# Altium schematic sheet Pi_HDMI.SchDoc: =DocumentName
size B; DrawnBy: Cary Smith; Organization: Las Cumbres Observatoy; Address1: 6740 Cortona Dr.; Address2: Suite 102; Address3: Goleta, CA 93117; DocumentNumber: 1; Revision: 1; SheetNumber: 1; SheetTotal: 1000's
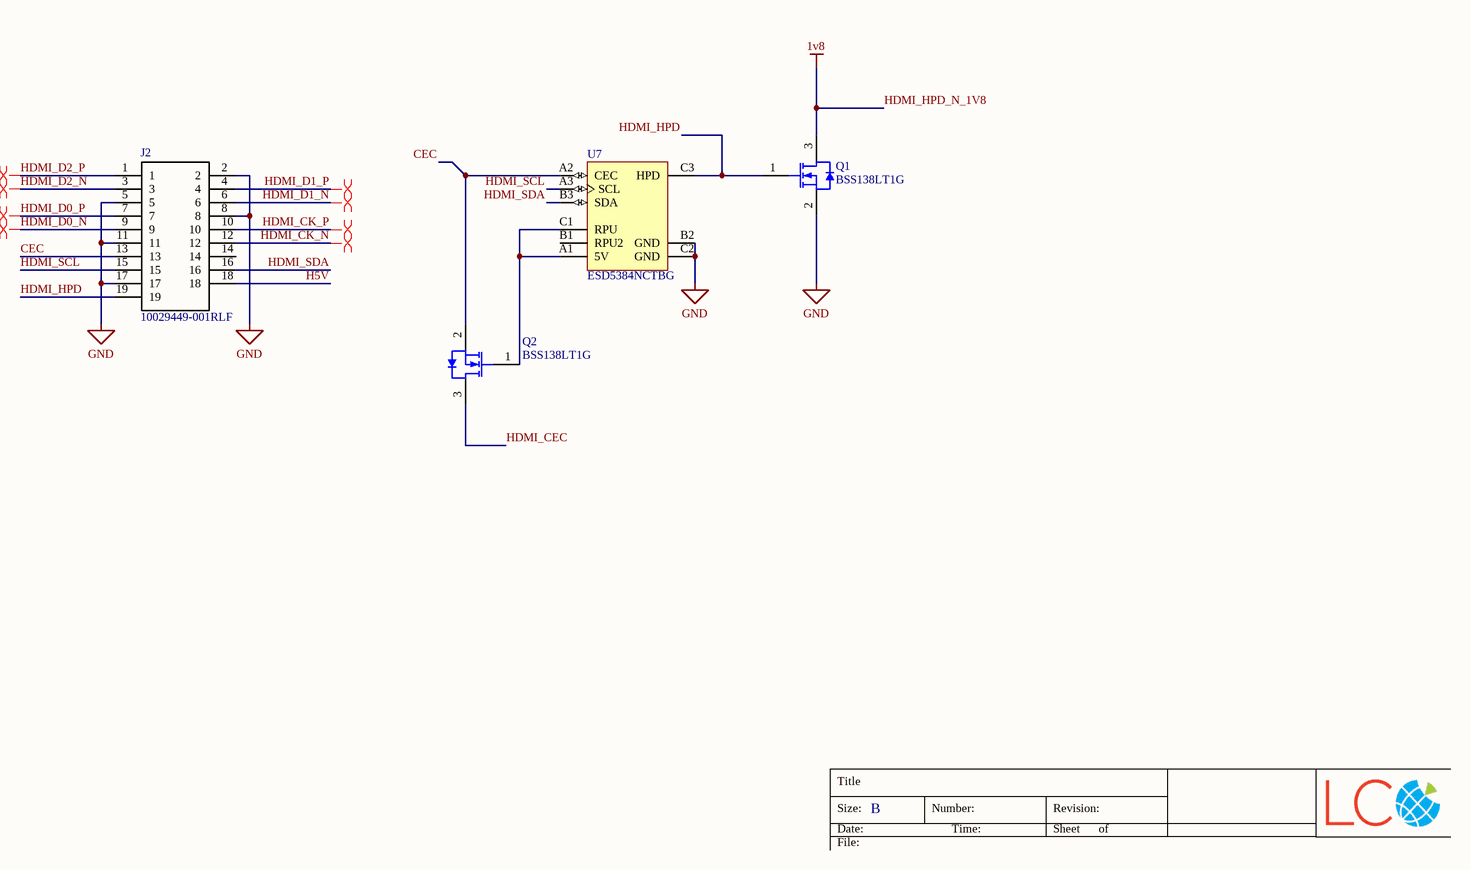
[diagram p0: Pi_HDMI.SchDoc]

## Parts
J2  10029449-001RLF  [10029449-001RLF_FCI]
Q1  BSS138LT1G  [ONSC-SOT-23-3-318-08_V]
Q2  BSS138LT1G  [ONSC-SOT-23-3-318-08_V]
U7  ESD5384NCTBG  [ONSC-WLCSP-9-567CX-01]

## Nets
GND: J2.2 J2.5 J2.8 J2.11 J2.17 Q1.2(S) U7.B2(GND) U7.C2(GND)
HDMI_HPD_N_1V8: Q1.3(D)  [also labelled 1v8]
CEC: J2.13 Q2.2(S) U7.A2(CEC)
H5V: J2.18
HDMI_CEC: Q2.3(D)
HDMI_CK_N: J2.12
HDMI_CK_P: J2.10
HDMI_D0_N: J2.9
HDMI_D0_P: J2.7
HDMI_D1_N: J2.6
HDMI_D1_P: J2.4
HDMI_D2_N: J2.3
HDMI_D2_P: J2.1
HDMI_HPD: J2.19 Q1.1(G) U7.C3(HPD)
HDMI_SCL: J2.15 U7.A3(SCL)
HDMI_SDA: J2.16 U7.B3(SDA)
NetQ2_1: Q2.1(G) U7.A1(5V) U7.C1(RPU)

Not connected (* = marked no-connect by the designer): J2 14; U7 B1(RPU2)

## Layout directives
differential pair: HDMI_CK_N, HDMI_CK_P, HDMI_D0_N, HDMI_D0_P, HDMI_D1_N, HDMI_D1_P, HDMI_D2_N, HDMI_D2_P

## Notes on the sheet
- Title
- Size:
- Date:
- B
- Number:
- Time:
- Revision:
- Sheet
- of
- File:

## Library data of the parts
J2 = 10029449-001RLF: Connector; Manufacturer_Name: FCI; Allied_Number: 70247646; Datasheet Link: https://componentsearchengine.com/Datasheets/2/10029449-001RLF.pdf; Manufacturer_Part_Number: 10029449-001RLF; Mouser Part Number: 649-10029449-001RLF; Mouser Price/Stock: https://www.mouser.com/Search/Refine.aspx?Keyword=649-10029449-001RLF; RS Part Number: 1621999; RS Price/Stock: http://uk.rs-online.com/web/p/products/1621999; Allied Price/Stock: https://www.alliedelec.com/amphenol-fci-10029449-001rlf/70247646/
Q1 Q2 = CMP-1058-00767-1: Power MOSFET, 200 mA, 50 V, N-Channel, 3-Pin SOT-23, Pb-Free, Tape and Reel; Manufacturer: On Semiconductor; PD Max (W): 0.225; Coss Typ (pF): 12; V(BR)DSS Min (V): 50; VGS Max (V): 20; Channel Polarity: N Channel; Configuration: Single; VGS(th) Max (V): 1.5; Ciss Typ (pF): 40; Crss Typ (pF): 3.5; ID Max (A): 0.2; ComponentLink3Description: Package Specification; PackageDescription: 3-Pin Small Outline Transistor, Body 2.92 x 1.3 mm, Pitch 0.95 mm; PackageReference: SOT-23-3-318-08; RoHS: Pb-Free; Mounting Technology: Surface Mount; ComponentLink1Description: Manufacturer URL; ComponentLink2URL: http://www.onsemi.com/pub_link/Collateral/BSS138LT1-D.PDF; ComponentLink2Description: Datasheet; Packing: Tape and Reel; PackageVersion: Rev. AP, 11/2009; PartNumber: BSS138LT1G; Package Type: SOT-23-3; ComponentLink1URL: http://www.onsemi.com/; DatasheetVersion: Rev. 8; ComponentLink3URL: http://www.onsemi.cn/pub_link/Collateral/318-08.PDF
U7 = CMP-1063-00280-1: 5-Line HDMI Control Line, ESD Protection, 9-Pin WLCSP, Pb-Free, Tape and Reel; Manufacturer: On Semiconductor; Direction: Unidirectional; V(BR) Min (V): 6; Number of Lines: 5; ComponentLink1URL: http://www.onsemi.com/; DatasheetVersion: Rev. 0; ComponentLink2URL: http://www.onsemi.cn/pub_link/Collateral/ESD5384-D.PDF; PackageDescription: 9-Ball Wafer Level Chip Scale Package, Body 1.14 x 1.14 mm, Pitch 0.4 mm; Packing: Tape and Reel; ComponentLink3URL: http://www.onsemi.cn/pub_link/Collateral/567CX.PDF; PackageVersion: Rev. O, 10/2010; PackageReference: WLCSP-9-567CX-01; ComponentLink3Description: Package Specification; RoHS: Pb-Free; PartNumber: ESD5384NCTBG; ComponentLink1Description: Manufacturer URL; Mounting Technology: Surface Mount; ComponentLink2Description: Datasheet